# EAGLE design Interconnect_board_limit_switches_v1p0 (EAGLE 9.3.1)
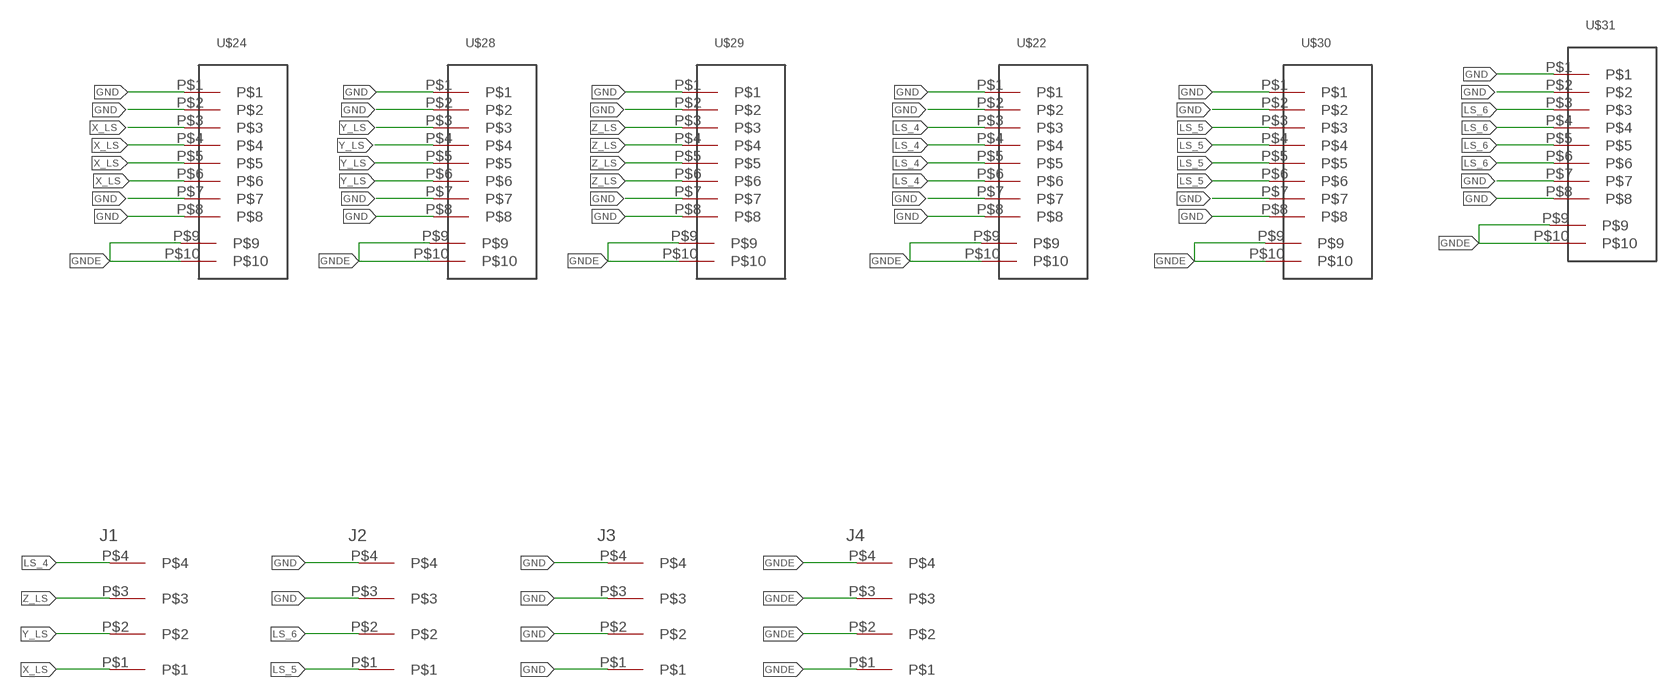
[diagram p0: schematic, sheet 1]

## Parts
J1  3.81MM_1_X_4_RT_ANGLE_PLUG_HEADER  [1X4_3.81MM_PITCH]
J2  3.81MM_1_X_4_RT_ANGLE_PLUG_HEADER  [1X4_3.81MM_PITCH]
J3  3.81MM_1_X_4_RT_ANGLE_PLUG_HEADER  [1X4_3.81MM_PITCH]
J4  3.81MM_1_X_4_RT_ANGLE_PLUG_HEADER  [1X4_3.81MM_PITCH]
U$22  RJ45_SMTRJ  [RJ45_SMT]
U$24  RJ45_SMTRJ  [RJ45_SMT]
U$28  RJ45_SMTRJ  [RJ45_SMT]
U$29  RJ45_SMTRJ  [RJ45_SMT]
U$30  RJ45_SMTRJ  [RJ45_SMT]
U$31  RJ45_SMTRJ  [RJ45_SMT]

## Nets
GND: J2.P$3 J2.P$4 J3.P$1 J3.P$2 J3.P$3 J3.P$4 U$22.P$1 U$22.P$2 U$22.P$7 U$22.P$8 U$24.P$1 U$24.P$2 U$24.P$7 U$24.P$8 U$28.P$1 U$28.P$2 U$28.P$7 U$28.P$8 U$29.P$1 U$29.P$2 U$29.P$7 U$29.P$8 U$30.P$1 U$30.P$2 U$30.P$7 U$30.P$8 U$31.P$1 U$31.P$2 U$31.P$7 U$31.P$8
GNDE: J4.P$1 J4.P$2 J4.P$3 J4.P$4 U$22.P$9 U$22.P$10 U$24.P$9 U$24.P$10 U$28.P$9 U$28.P$10 U$29.P$9 U$29.P$10 U$30.P$9 U$30.P$10 U$31.P$9 U$31.P$10
LS_4: J1.P$4 U$22.P$3 U$22.P$4 U$22.P$5 U$22.P$6
LS_5: J2.P$1 U$30.P$3 U$30.P$4 U$30.P$5 U$30.P$6
LS_6: J2.P$2 U$31.P$3 U$31.P$4 U$31.P$5 U$31.P$6
X_LS: J1.P$1 U$24.P$3 U$24.P$4 U$24.P$5 U$24.P$6
Y_LS: J1.P$2 U$28.P$3 U$28.P$4 U$28.P$5 U$28.P$6
Z_LS: J1.P$3 U$29.P$3 U$29.P$4 U$29.P$5 U$29.P$6

## Library data of the parts
J1-J4 = 3D_MIG_Controller:3.81MM_1_X_4_RT_ANGLE_PLUG_HEADER
U$22 U$24 U$28-U$31 = 3D_MIG_Controller:RJ45_SMT

## Board
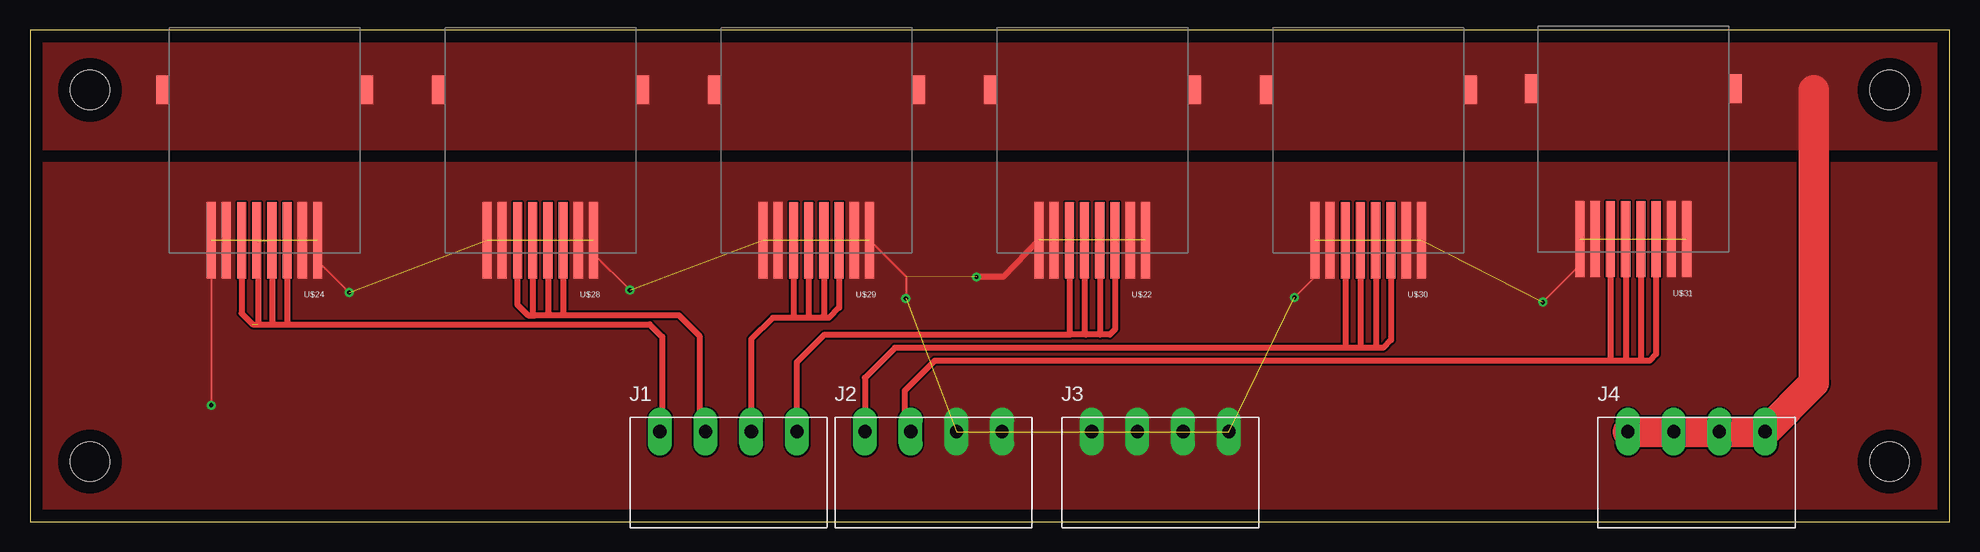
[diagram p1: board, top side]
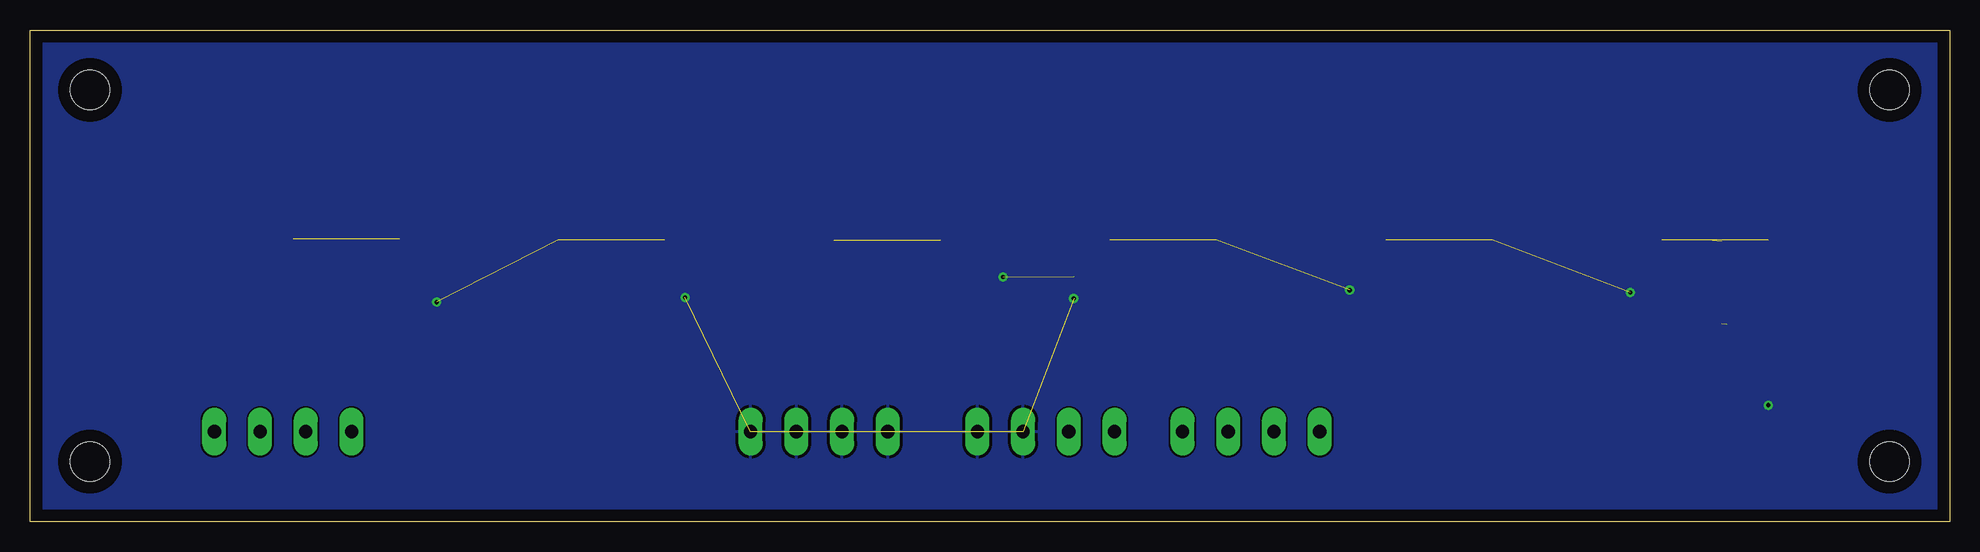
[diagram p2: board, bottom side, seen from below]

Size 160 x 41 mm. Coordinates in mm from the lower left corner, seen from the top.
Outline: 0,0 160,0 160,41 0,41 0,0
Copper layers (1*16): Top 0.035mm / dielectric 1.5mm / Bottom 0.035mm
Design rules "default": minimum track width 6mil, minimum drill 0.35mm, track to track 6mil, track to pad 6mil, pad to pad 6mil, via to via 6mil, smd to smd 6mil, copper to edge 40mil, drill to drill 6mil, minimum pad ring 10mil, minimum via ring 8mil, stop-mask expansion 4mil, vias tented up to drill 0mil, thermal gap 10mil
Holes 3.3 mm at 5,36 5,5 155,5 155,36

### Footprints (pad centres in the part's own frame; a part is rotated, then mirrored left to right if it is on the bottom)
1X4_3.81MM_PITCH = drill 1.1 pad 2 long: P$1 0,0; P$2 3.81,0; P$3 7.62,0; P$4 11.43,0
RJ45_SMT = smd 0.76 x 6.35: P$1 -3.18,8.94; P$2 -1.91,8.94; P$3 -0.64,8.94; P$4 0.63,8.94; P$5 1.9,8.94; P$6 3.17,8.94; P$7 4.44,8.94; P$8 5.71,8.94 | smd 1.1 x 2.4: P$9 -7.25,-3.6; P$10 9.75,-3.6

### Placement (x,y rotation side)
J1  52.5,7.5 0 top
J2  69.6,7.5 0 top
J3  88.5,7.5 0 top
J4  133.2,7.5 0 top
U$22  89.8,32.4 180 top
U$24  20.8,32.4 180 top
U$28  43.8,32.4 180 top
U$29  66.8,32.4 180 top
U$30  112.8,32.4 180 top
U$31  134.9,32.5 180 top

### Tracks (layer width: path | path; a pad name or v marks a point on that pad's centre or on a via)
GND  (via drill 0.35)  (29 unrouted)
  Top 0.152: U$24.P$8 v15.09,9.71 v15.1,9.7 | U$29.P$1 73,20.44 v73,18.6 | U$28.P$1 46.98,22.32 v50,19.3 | U$24.P$1 23.98,21.72 v26.6,19.1 | U$30.P$8 107.09,20.39 v105.4,18.7 | U$31.P$8 129.19,21.39 v126.1,18.3
  Top 0.508: U$22.P$8 81.13,20.4 v78.9,20.4
  pour Top (no thermals): 0,30 160,30 160,0 0,0
  pour Bottom: 0,41 160,41 160,0 0,0
GNDE
  Top 2.54: J4.P$1 J4.P$2 J4.P$3 J4.P$4 148.7,11.57 148.7,36
  pour Top (no thermals): 0,41 160,41 160,31 0,31
LS_4
  Top 0.508: J1.P$4 63.93,13.3 66.23,15.6 86.7,15.6 | U$22.P$3 90.44,16.04 90,15.6 89.2,15.6 | 89.2,15.6 88,15.6 | 88,15.6 86.7,15.6 | U$22.P$4 89.17,15.63 89.2,15.6 | U$22.P$5 87.9,15.7 88,15.6 | U$22.P$6 86.63,15.67 86.7,15.6
LS_5
  Top 0.508: U$30.P$3 113.44,15.14 112.8,14.5 112.2,14.5 | 112.2,14.5 110.9,14.5 | 110.9,14.5 109.7,14.5 | 109.7,14.5 72.1,14.5 69.6,12 J2.P$1 | U$30.P$6 109.63,14.57 109.7,14.5 | U$30.P$4 112.17,14.53 112.2,14.5 | U$30.P$5 110.9,14.5
LS_6
  Top 0.508: 131.7,23.53 U$31.P$6 131.73,13.57 131.9,13.4 | J2.P$2 72.91,8 72.91,10.91 75.4,13.4 131.9,13.4 | 134.4,13.4 135,13.4 135.54,13.94 U$31.P$3 | 134.4,13.4 133.1,13.4 | 133.1,13.4 131.9,13.4 | U$31.P$4 134.27,13.53 134.4,13.4 | U$31.P$5 133,13.5 133.1,13.4
X_LS  (2 unrouted)
  Top 0.508: U$24.P$4 20.17,16.5 | U$24.P$5 19,23.36 19,16.5 | 21.6,16.44 18.56,16.44 17.63,17.37 U$24.P$6 | 21.6,16.44 51.66,16.44 52.7,15.4 52.7,7.7 J1.P$1 | U$24.P$3 21.44,16.6 21.6,16.44
Y_LS
  Top 0.508: U$28.P$6 40.63,18.07 41.5,17.2 42.1,17.2 | 43.4,17.2 42.1,17.2 | U$28.P$5 41.9,17.4 42.1,17.2 | U$28.P$4 43.17,17.43 43.4,17.2 | J1.P$2 55.81,8 55.81,15.49 54.1,17.2 44.5,17.2 | 44.5,17.2 43.4,17.2 | U$28.P$3 44.44,17.26 44.5,17.2
Z_LS
  Top 0.508: U$29.P$6 63.63,17.03 63.6,17 | U$29.P$3 67.44,17.84 66.6,17 66,17 | 66,17 65.1,17 | 65.1,17 63.6,17 | 63.6,17 61.9,17 60.12,15.22 J1.P$3 | U$29.P$4 66.17,17.17 66,17 | U$29.P$5 64.9,17.2 65.1,17